# EAGLE design FlybackCape (EAGLE 7.2.0)

## Sheet 1 of 2
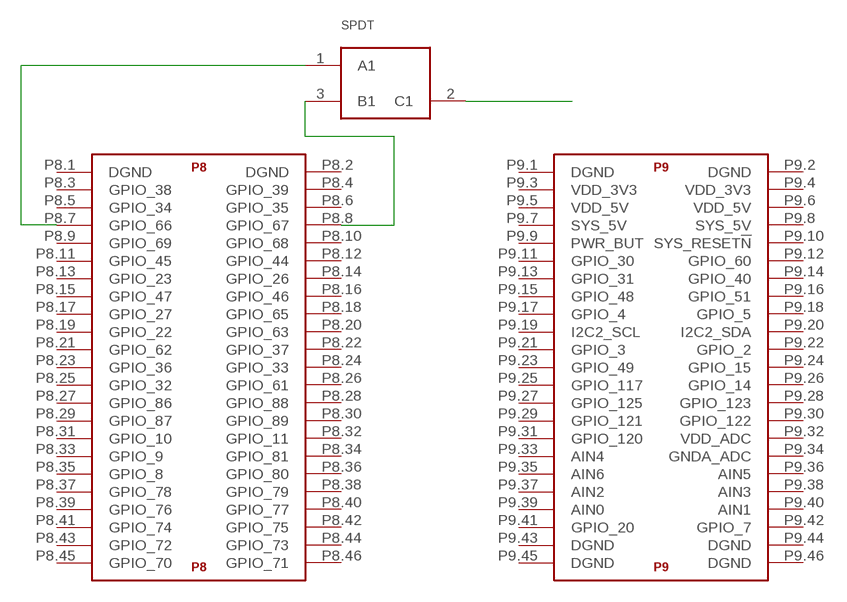
[diagram p0: schematic, sheet 1]

### Parts
SPDT  SPDT_SWITCH  [SPDT]
U$2  BEAGLE_BONE_BLACK_CAPE  [BEAGLE_BONE_BLACK_CAPE]

### Nets
EN: SPDT.2(C1) ; also sheet 2
N$10: SPDT.1(A1) U$2.P8.7(P8:GPIO_66)
N$12: SPDT.3(B1) U$2.P8.8(P8:GPIO_67)
Unconnected: U$2.P8.1(P8:DGND) U$2.P8.2(P8:DGND) U$2.P8.3(P8:GPIO_38) U$2.P8.4(P8:GPIO_39) U$2.P8.5(P8:GPIO_34) U$2.P8.6(P8:GPIO_35) U$2.P8.9(P8:GPIO_69) U$2.P8.10(P8:GPIO_68) U$2.P8.11(P8:GPIO_45) U$2.P8.12(P8:GPIO_44) U$2.P8.13(P8:GPIO_23) U$2.P8.14(P8:GPIO_26) U$2.P8.15(P8:GPIO_47) U$2.P8.16(P8:GPIO_46) U$2.P8.17(P8:GPIO_27) U$2.P8.18(P8:GPIO_65) U$2.P8.19(P8:GPIO_22) U$2.P8.20(P8:GPIO_63) U$2.P8.21(P8:GPIO_62) U$2.P8.22(P8:GPIO_37) U$2.P8.23(P8:GPIO_36) U$2.P8.24(P8:GPIO_33) U$2.P8.25(P8:GPIO_32) U$2.P8.26(P8:GPIO_61) U$2.P8.27(P8:GPIO_86) U$2.P8.28(P8:GPIO_88) U$2.P8.29(P8:GPIO_87) U$2.P8.30(P8:GPIO_89) U$2.P8.31(P8:GPIO_10) U$2.P8.32(P8:GPIO_11) U$2.P8.33(P8:GPIO_9) U$2.P8.34(P8:GPIO_81) U$2.P8.35(P8:GPIO_8) U$2.P8.36(P8:GPIO_80) U$2.P8.37(P8:GPIO_78) U$2.P8.38(P8:GPIO_79) U$2.P8.39(P8:GPIO_76) U$2.P8.40(P8:GPIO_77) U$2.P8.41(P8:GPIO_74) U$2.P8.42(P8:GPIO_75) U$2.P8.43(P8:GPIO_72) U$2.P8.44(P8:GPIO_73) U$2.P8.45(P8:GPIO_70) U$2.P8.46(P8:GPIO_71) U$2.P9.1(P9:DGND) U$2.P9.2(P9:DGND) U$2.P9.3(P9:VDD_3V3) U$2.P9.4(P9:VDD_3V3) U$2.P9.5(P9:VDD_5V) U$2.P9.6(P9:VDD_5V) U$2.P9.7(P9:SYS_5V) U$2.P9.8(P9:SYS_5V) U$2.P9.9(P9:PWR_BUT) U$2.P9.10(P9:SYS_RESET!N) U$2.P9.11(P9:GPIO_30) U$2.P9.12(P9:GPIO_60) U$2.P9.13(P9:GPIO_31) U$2.P9.14(P9:GPIO_40) U$2.P9.15(P9:GPIO_48) U$2.P9.16(P9:GPIO_51) U$2.P9.17(P9:GPIO_4) U$2.P9.18(P9:GPIO_5) U$2.P9.19(P9:I2C2_SCL) U$2.P9.20(P9:I2C2_SDA) U$2.P9.21(P9:GPIO_3) U$2.P9.22(P9:GPIO_2) U$2.P9.23(P9:GPIO_49) U$2.P9.24(P9:GPIO_15) U$2.P9.25(P9:GPIO_117) U$2.P9.26(P9:GPIO_14) U$2.P9.27(P9:GPIO_125) U$2.P9.28(P9:GPIO_123) U$2.P9.29(P9:GPIO_121) U$2.P9.30(P9:GPIO_122) U$2.P9.31(P9:GPIO_120) U$2.P9.32(P9:VDD_ADC) U$2.P9.33(P9:AIN4) U$2.P9.34(P9:GNDA_ADC) U$2.P9.35(P9:AIN6) U$2.P9.36(P9:AIN5) U$2.P9.37(P9:AIN2) U$2.P9.38(P9:AIN3) U$2.P9.39(P9:AIN0) U$2.P9.40(P9:AIN1) U$2.P9.41(P9:GPIO_20) U$2.P9.42(P9:GPIO_7) U$2.P9.43(P9:DGND) U$2.P9.44(P9:DGND) U$2.P9.45(P9:DGND) U$2.P9.46(P9:DGND)

## Sheet 2 of 2
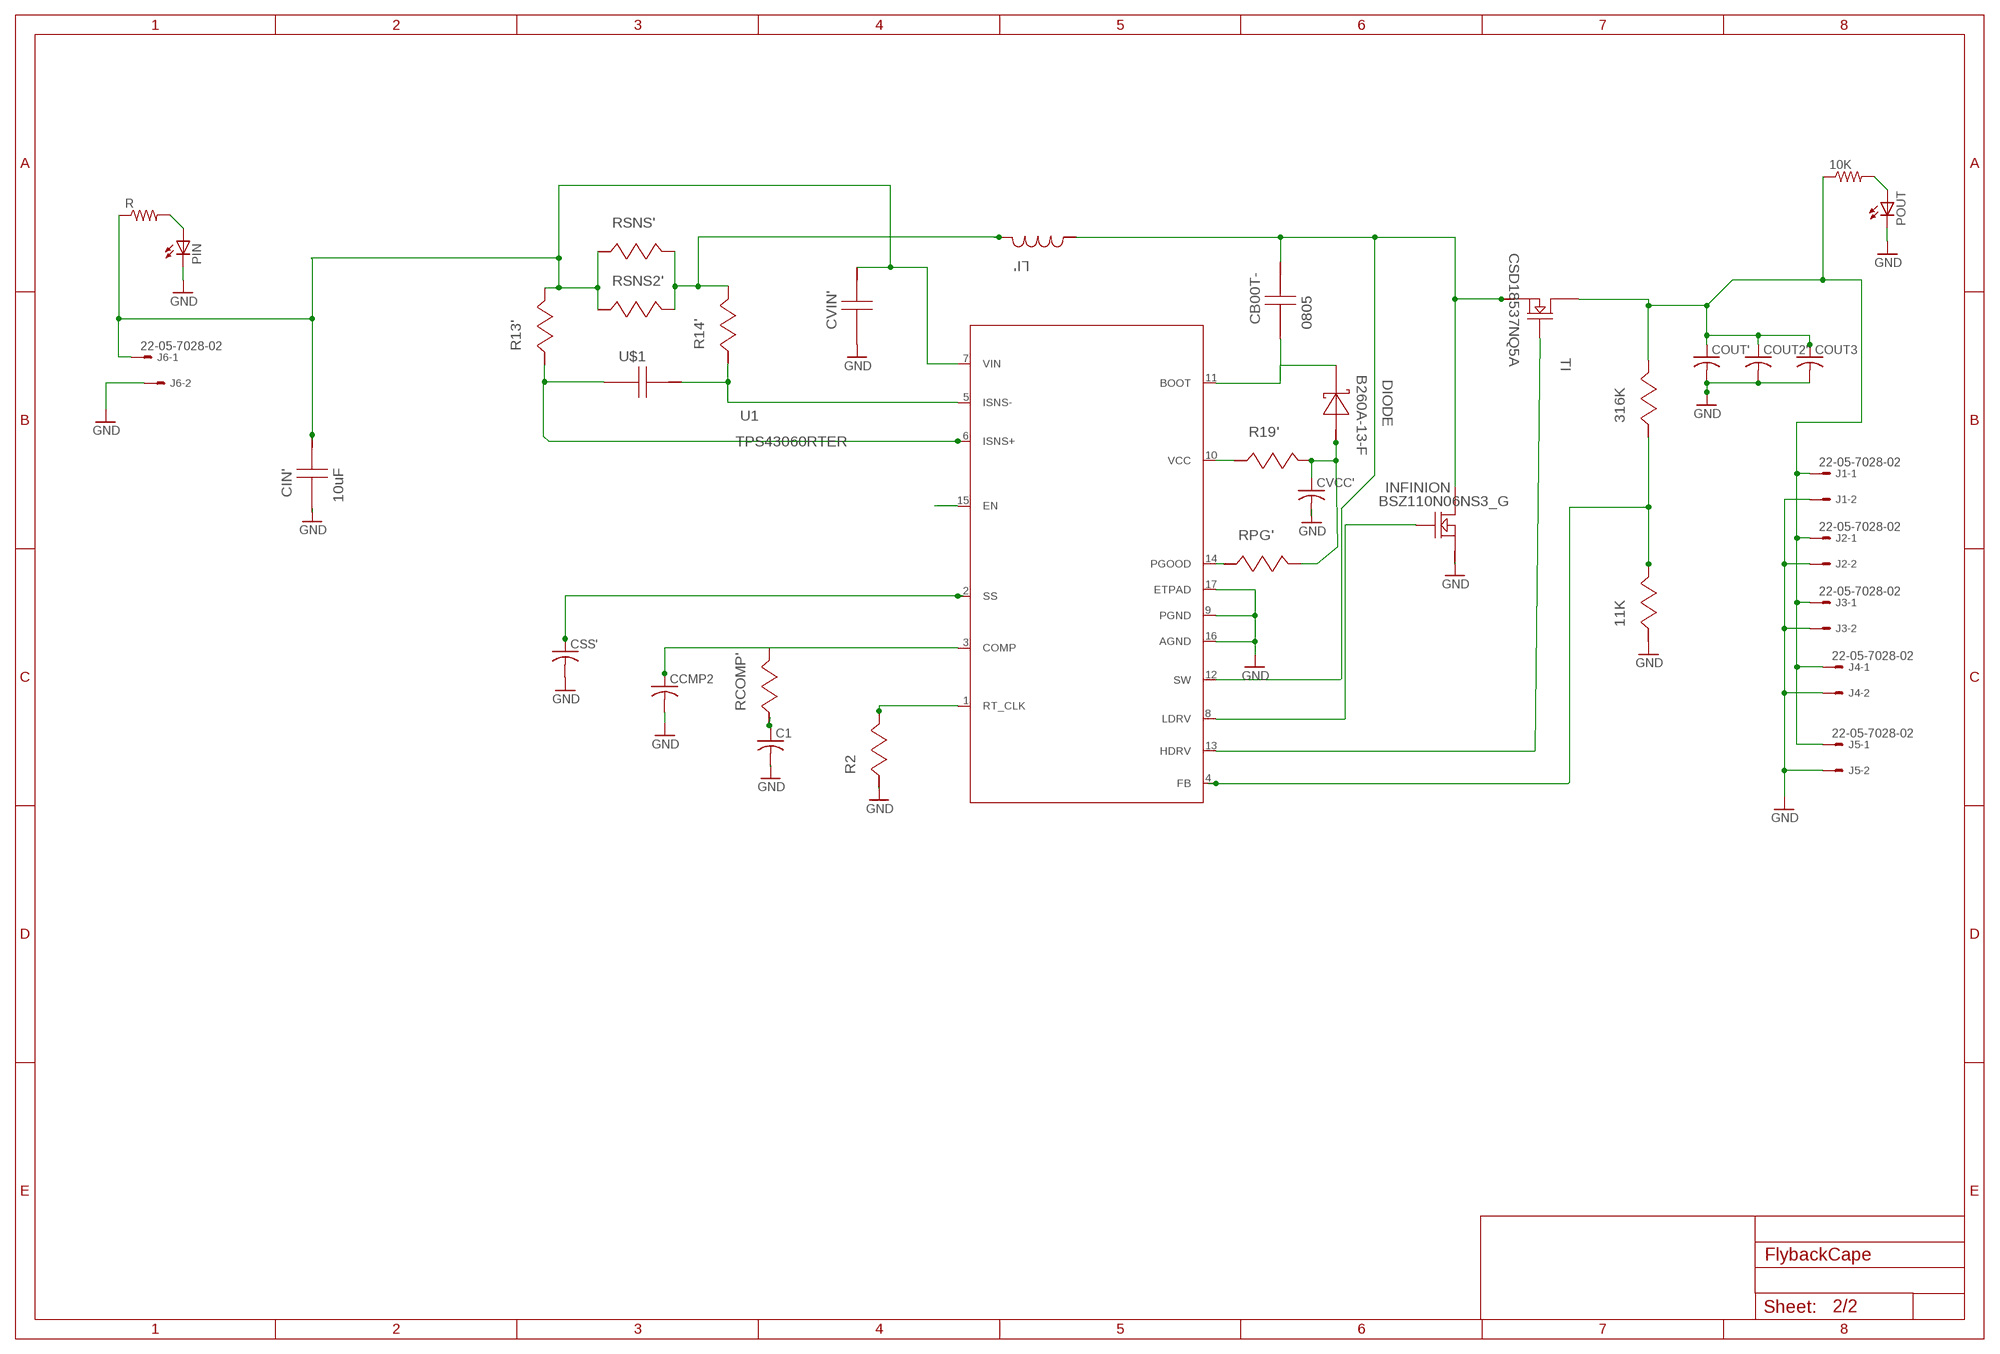
[diagram p1: schematic, sheet 2]

### Parts
10K  R-US_R1206  [R1206]
11K  CRCW0402110KFKED  [0402]
316K  CRCW0402110KFKED  [0402]
C1  C-USC0805  [C0805]
CB00T-  0805  08053C104KAT2A  [0805]
CCMP2  C-USC0402  [C0402]
CIN'  10uF  C3225X7S2A475M  [1210]
COUT2'  C-USC1812  [C1812]
COUT3  C-USC1812  [C1812]
COUT'  C-USC1812  [C1812]
CSS'  C-USC0603K  [C0603K]
CVCC'  C-USC0805  [C0805]
CVIN'  08053C104KAT2A  [0805]
DIODE  B260A-13-F  [SMA]
INFINION  BSZ110N06NS3_G  [PG-TSDSON-8]
J1  22-05-7028-02  [7395-02]
J2  22-05-7028-02  [7395-02]
J3  22-05-7028-02  [7395-02]
J4  22-05-7028-02  [7395-02]
J5  22-05-7028-02  [7395-02]
J6  22-05-7028-02  [7395-02]
LI'  MSS1210-153MEB  [MSS1210]
PIN  LEDCHIPLED_1206  [CHIPLED_1206]
POUT  LEDCHIPLED_1206  [CHIPLED_1206]
R  R-US_R1206  [R1206]
R2  CRCW04023K32FKED  [0402]
R13'  CRCW04022R00FKED  [0402]
R14'  CRCW04022R00FKED  [0402]
R19'  CRCW04022R00FKED  [0402]
RCOMP'  CRCW04023K32FKED  [0402]
RPG'  CRCW0402100KFKED  [0402]
RSNS2'  PRL1632-R012-F-T1  [1206]
RSNS'  PRL1632-R012-F-T1  [1206]
TI  CSD18537NQ5A  [TRANS_NEXFET_Q5A]
U1  TPS43060RTER  [S-PVQFN-N16]
U$1  GRM188R61C106MA73D  [0603]

### Nets
CSS: CSS'.1 U1.2(SS)
EN: U1.15(EN) ; also sheet 1
GND: 11K.2 C1.2 CCMP2.2 CIN'.2 COUT2'.2 COUT3.2 COUT'.2 CSS'.2 CVCC'.2 CVIN'.2 INFINION.1(SOURCE_2) INFINION.2(SOURCE_2) INFINION.3(SOURCE_2) J1.2 J2.2 J3.2 J4.2 J5.2 J6.2 PIN.C POUT.C R2.2 U1.9(PGND) U1.16(AGND) U1.17(ETPAD)
LNEG: CB00T-.1 INFINION.5(DRAIN_2) INFINION.6(DRAIN_2) INFINION.7(DRAIN_2) INFINION.8(DRAIN_2) INFINION.9(DRAIN_2) LI'.2 TI.1(SOURCE_2) TI.2(SOURCE_2) TI.3(SOURCE_2) U1.12(SW)
LPOS: LI'.1 R14'.1 RSNS2'.1 RSNS'.1
N$1: INFINION.4(GATE) U1.8(LDRV)
N$3: CB00T-.2 DIODE.1(K) U1.11(BOOT)
N$4: CVCC'.1 DIODE.2(A) R19'.1 RPG'.1
N$5: R19'.2 U1.10(VCC)
N$6: RPG'.2 U1.14(PGOOD)
N$7: 10K.2 POUT.A
N$8: PIN.A R.2
N$9: 11K.1 316K.2 U1.4(FB)
N$11: C1.1 RCOMP'.2
N$13: R14'.2 U1.5(ISNS-) U$1.1
N$14: R13'.2 U1.6(ISNS+) U$1.2
N$15: R2.1 U1.1(RT_CLK)
N$16: CCMP2.1 RCOMP'.1 U1.3(COMP)
TI: TI.4(GATE) U1.13(HDRV)
VIN: CIN'.1 CVIN'.1 J6.1 R13'.1 R.1 RSNS2'.2 RSNS'.2 U1.7(VIN)
VOUT: 10K.1 316K.1 COUT2'.1 COUT3.1 COUT'.1 J1.1 J2.1 J3.1 J4.1 J5.1 TI.5(DRAIN_2) TI.6(DRAIN_2) TI.7(DRAIN_2) TI.8(DRAIN_2) TI.9(DRAIN_2)

## Library data of the parts
10K R = rcl:R-US_: RESISTOR, American symbol
11K 316K = flybackWebBench:CRCW0402110KFKED; MANUFACTURER_NAME: Vishay-Dale; MANUFACTURER_PART_NUMBER: CRCW0402110KFKED; POWER: 0.063; RESISTANCE: 110000.0; TOLERANCE: 1.0; VENDOR: Vishay-Dale
C1 CCMP2 COUT2' COUT3 COUT' CSS' CVCC' = rcl:C-US: CAPACITOR, American symbol
CB00T- CVIN' = flybackWebBench:08053C104KAT2A; CAP: 1.0E-7; ESR: 0.28; IRMS: 0.0; MANUFACTURER_NAME: AVX; MANUFACTURER_PART_NUMBER: 08053C104KAT2A; VDC: 25.0; VENDOR: AVX
CIN' = flybackWebBench:C3225X7S2A475M; CAP: 4.7E-6; DATASHEETURL: http://www.tdk.co.jp/tefe02/e4655%5Fc.pdf; ESR: 0.004547; IRMS: 0.0; MANUFACTURER_NAME: TDK; MANUFACTURER_PART_NUMBER: C3225X7S2A475M; VDC: 100.0; VENDOR: TDK
DIODE = flybackWebBench:B260A-13-F; DATASHEETURL: http://www.diodes.com/datasheets/ds13004.pdf; IO: 2.0; MANUFACTURER_NAME: Diodes Inc.; MANUFACTURER_PART_NUMBER: B260A-13-F; VENDOR: Diodes Inc.; VFATIO: 0.7; VRRM: 60.0
INFINION = flybackWebBench:BSZ110N06NS3_G; DATASHEETURL: http://www.infineon.com/dgdl/BSZ110N06NS3%5FRev2.4.pdf?folderId%3Ddb3a30431ddc9372011ebafa04517f8b%26fileId%3Ddb3a30431ddc9372011ebb15d4e8001a; IDSMAX: 20.0; MANUFACTURER_NAME: Infineon Technologies; MANUFACTURER_PART_NUMBER: BSZ110N06NS3 G; QGTYP: 25.0; QUANTITY: 1; RDSON45: 101.0; VDSMAX: 60.0; VENDOR: Infineon Technologies
J1-J6 = range_cape:22-?-02: CONNECTOR wire to board 2.54 mm (.1 inch) pitch header; OC_FARNELL: 9731601; OC_NEWARK: unknown
LI' = flybackWebBench:MSS1210-153MEB; DATASHEETURL: http://www.coilcraft.com/pdfs/mss1210.pdf; DCR: 0.019; DESCRIPTION: Unknown; IDC: 8.7; L: 1.5E-5; MANUFACTURER: CoilCraft; MANUFACTURER_NAME: Coilcraft; MANUFACTURER_PART_NUMBER: MSS1210-153MEB; PACKAGE_DESIGNATOR: MSS1210; VENDOR: Coilcraft
PIN POUT = led:LED: LED OSRAM: - CHIPLED LG R971, LG N971, LY N971, LG Q971, LY Q971, LO R971, LY R971 LH N974, LH R974 LS Q976, LO Q976, LY Q976 LO Q996 - Hyper CHIPLED LW Q18S LB Q993, LB Q99A, LB R99A - SideLED LS A670, LO A670, LY A670, LG A670, LP A670 LB A673, LV A673, LT A673, LW A673 LH A674 LY A675 LS A676, LA A676, LO A676, LY A676, LW A676 LS A679, LY A679, LG A679 - Hyper Micro SIDELED® LS Y876, LA Y876, LO Y876, LY Y876 LT Y87S - SmartLED LW L88C, LW L88S LB L89C, LB L89S, LG L890 LS L89K, LO L89K, LY L89K LS L896, LA L896, LO L896, LY L896 - TOPLED LS T670, LO T670, LY T670, LG T670, LP T670 LSG T670, LSP T670, LSY T670, LOP T670, LYG T670 LG T671, LOG T671, LSG T671 LB T673, LV T673, LT T673, LW T673 LH T674 LS T676, LA T676, LO T676, LY T676, LB T676, LH T676, LSB T676, LW T676 LB T67C, LV T67C, LT T67C, LS T67K, LO T67K, LY T67K, LW E67C LS E67B, LA E67B, LO E67B, LY E67B, LB E67C, LV E67C, LT E67C LW T67C LS T679, LY T679, LG T679 LS T770, LO T770, LY T770, LG T770, LP T770 LB T773, LV T773, LT T773, LW T773 LH T774 LS E675, LA E675, LY E675, LS T675 LS T776, LA T776, LO T776, LY T776, LB T776 LHGB T686 LT T68C, LB T68C - Hyper Mini TOPLED® LB M676 - Mini TOPLED Santana® LG M470 LS M47K, LO M47K, LY M47K Source: http://www.osram.convergy.de LUXEON: - LUMILED® LXK2-PW12-R00, LXK2-PW12-S00, LXK2-PW14-U00, LXK2-PW14-V00 LXK2-PM12-R00, LXK2-PM12-S00, LXK2-PM14-U00 LXK2-PE12-Q00, LXK2-PE12-R00, LXK2-PE12-S00, LXK2-PE14-T00, LXK2-PE14-U00 LXK2-PB12-K00, LXK2-PB12-L00, LXK2-PB12-M00, LXK2-PB14-N00, LXK2-PB14-P00, LXK2-PB14-Q00 LXK2-PR12-L00, LXK2-PR12-M00, LXK2-PR14-Q00, LXK2-PR14-R00 LXK2-PD12-Q00, LXK2-PD12-R00, LXK2-PD12-S00 LXK2-PH12-R00, LXK2-PH12-S00 LXK2-PL12-P00, LXK2-PL12-Q00, LXK2-PL12-R00 Source: www.luxeon.com KINGBRIGHT: KA-3528ASYC Source: www.kingbright.com
R2 RCOMP' = flybackWebBench:CRCW04023K32FKED; MANUFACTURER_NAME: Vishay-Dale; MANUFACTURER_PART_NUMBER: CRCW04023K32FKED; POWER: 0.063; RESISTANCE: 3320.0; TOLERANCE: 1.0; VENDOR: Vishay-Dale
R13' R14' R19' = flybackWebBench:CRCW04022R00FKED; MANUFACTURER_NAME: Vishay-Dale; MANUFACTURER_PART_NUMBER: CRCW04022R00FKED; POWER: 0.063; RESISTANCE: 2.0; TOLERANCE: 1.0; VENDOR: Vishay-Dale
RPG' = flybackWebBench:CRCW0402100KFKED; MANUFACTURER_NAME: Vishay-Dale; MANUFACTURER_PART_NUMBER: CRCW0402100KFKED; POWER: 0.063; RESISTANCE: 100000.0; TOLERANCE: 1.0; VENDOR: Vishay-Dale
RSNS2' RSNS' = flybackWebBench:PRL1632-R012-F-T1; MANUFACTURER_NAME: Susumu Co Ltd; MANUFACTURER_PART_NUMBER: PRL1632-R012-F-T1; POWER: 1.0; RESISTANCE: 0.012; TOLERANCE: 1.0; VENDOR: Susumu Co Ltd
SPDT = range_cape:SPDT_SWITCH
TI = flybackWebBench:CSD18537NQ5A; DATASHEETURL: http://www.ti.com/lit/ds/symlink/csd18537nq5a.pdf; IDSMAX: 50.0; MANUFACTURER_NAME: Texas Instruments; MANUFACTURER_PART_NUMBER: CSD18537NQ5A; QGTYP: 14.0; QUANTITY: 1; RDSON45: 0.014559999999999998; VDSMAX: 60.0; VENDOR: Texas Instruments
U1 = flybackWebBench:TPS43060RTER; DATASHEETURL: http://www.ti.com/product/tps43060; FREQUENCY: 1000000.0; IMAX: 15.0; MANUFACTURER_NAME: Texas Instruments; MANUFACTURER_PART_NUMBER: TPS43060RTER; MKTG_PACKAGE: TPS43060; NSID: TPS43060RTER; PACKAGE: TPS43060; VENDOR: Texas Instruments
U$1 = flybackWebBench:GRM188R61C106MA73D; CAP: 1.0E-5; ESR: 0; IRMS: 0; MANUFACTURER_NAME: MuRata; MANUFACTURER_PART_NUMBER: GRM188R61C106MA73D; VDC: 16; VENDOR: Murata
U$2 = range_cape:BEAGLE_BONE_BLACK_CAPE

## Board
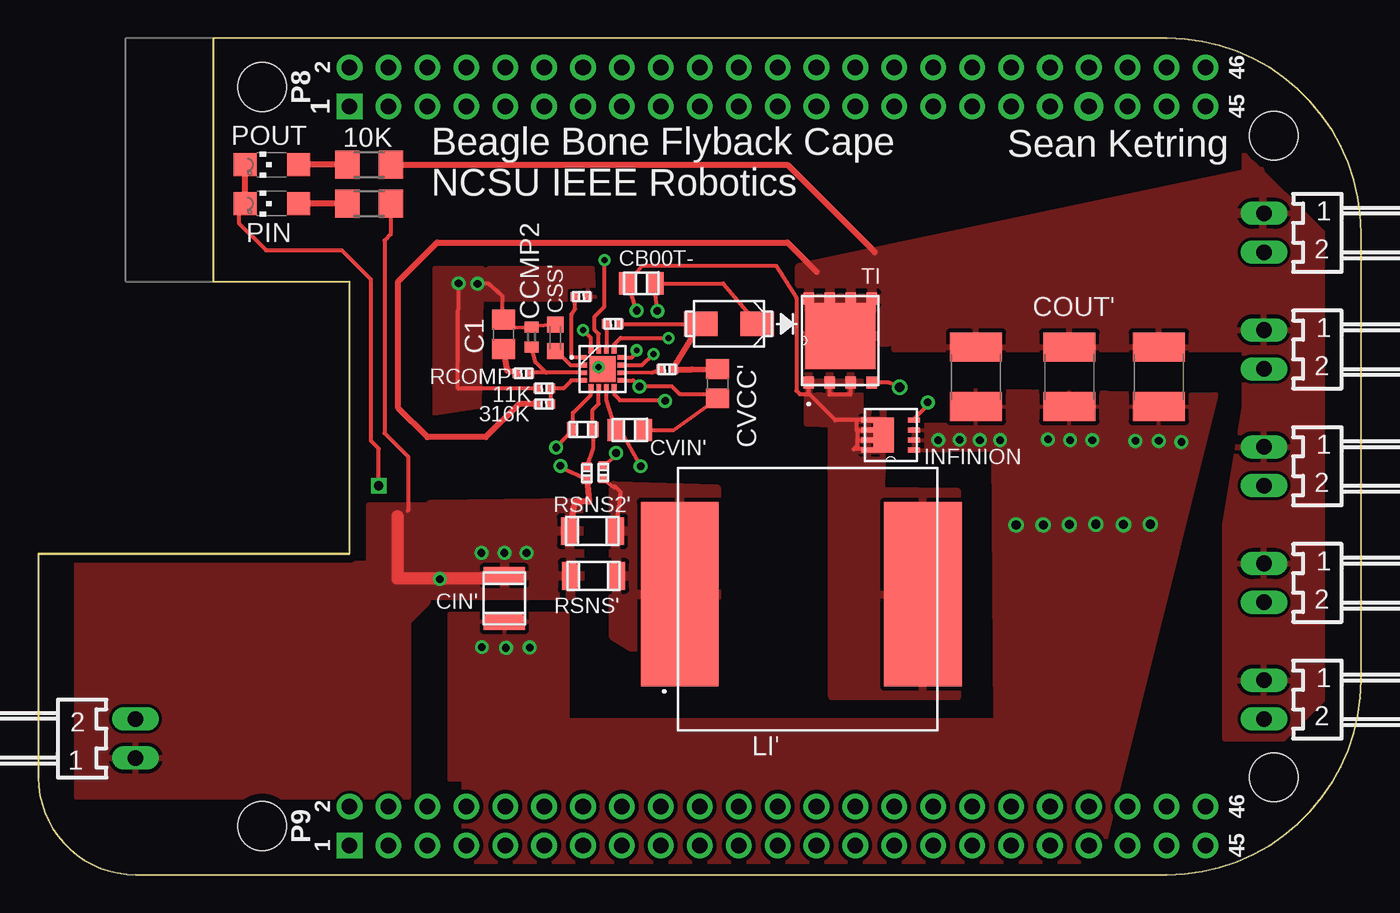
[diagram p2: board, top side]
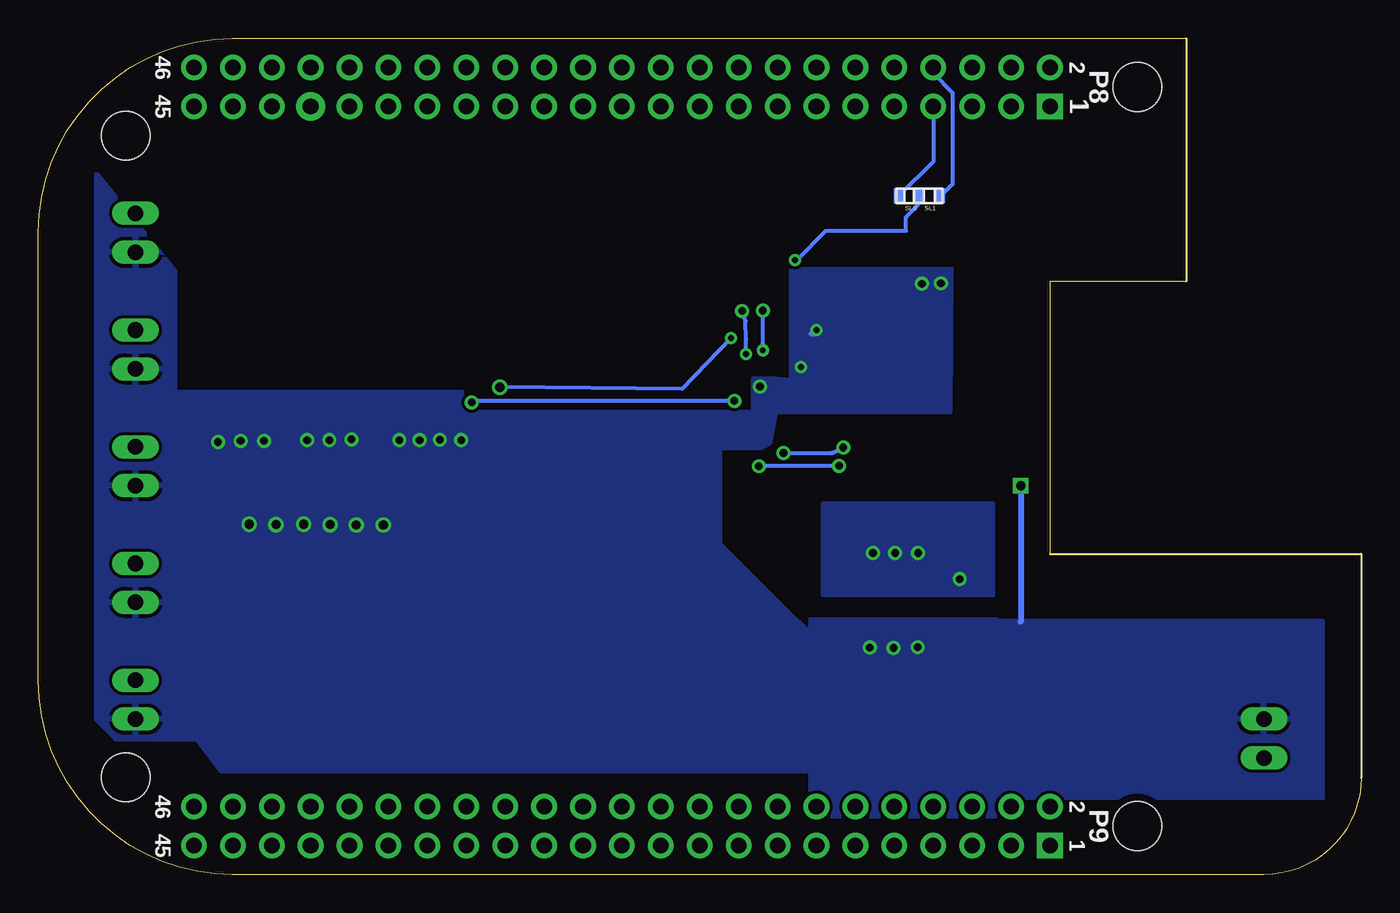
[diagram p3: board, bottom side, seen from below]

Size 86.36 x 54.61 mm. Coordinates in mm from the lower left corner, seen from the top.
Outline: 6.35,0 73.66,0 arc90 86.36,12.7 86.36,41.91 arc90 73.66,54.61 11.43,54.61 11.43,38.73 20.32,38.73 20.32,20.95 0,20.95 0,6.35 arc90 6.35,0
Copper layers (1*16): Top 0.035mm / dielectric 1.5mm / Bottom 0.035mm
Design rules "default *": minimum track width 10mil, minimum drill 15mil, track to track 8mil, track to pad 8mil, pad to pad 8mil, via to via 8mil, smd to smd 8mil, copper to edge 20mil, drill to drill 8mil, minimum pad ring 10mil, minimum via ring 8mil, stop-mask expansion 4mil, vias tented up to drill 0mil, thermal gap 10mil

### Footprints (pad centres in the part's own frame; a part is rotated, then mirrored left to right if it is on the bottom)
R1206 = smd 1.6 x 1.803: 1 -1.422,0; 2 1.422,0
0402 = smd 0.559 x 0.61: 1 -0.419,0; 2 0.419,0
C0805 = smd 1.3 x 1.5: 1 -0.95,0; 2 0.95,0
0805 = smd 1.118 x 1.448: 1 -0.902,0; 2 0.902,0
C0402 = smd 0.7 x 0.9: 1 -0.65,0; 2 0.65,0
1210 = smd 1.118 x 2.692: 1 -1.499,0; 2 1.499,0
C1812 = smd 1.9 x 3.4: 1 -1.95,0; 2 1.95,0
C0603K = smd 1.05 x 1.08: 1 -0.875,0; 2 0.875,0
SMA = smd 2.184 x 1.626: 1 -1.854,0; 2 1.854,0
PG-TSDSON-8 = smd 0.787 x 0.33: 1 -1.511,0.975; 2 -1.511,0.325; 3 -1.511,-0.325; 4 -1.511,-0.975; 5 1.511,-0.975; 6 1.511,-0.325; 7 1.511,0.325; 8 1.511,0.975 | smd 1.321 x 2.286: 9 0.457,0
7395-02 = drill 1.016 long: 1 1.27,0; 2 -1.27,0
MSS1210 = smd 5.08 x 12.065: 1 0.318,8.89; 2 16.192,8.89
CHIPLED_1206 = smd 1.5 x 1.5: A 0,-1.75; C 0,1.75
1206 = smd 1.118 x 1.803: 1 -1.499,0; 2 1.499,0
SPDT = smd 0.66 x 0.965: 1 -0.699,0; 2 0.572,0; 3 1.968,0
TRANS_NEXFET_Q5A = smd 0.787 x 0.711: 1 -2.752,2.055; 2 -2.752,0.685; 3 -2.752,-0.685; 4 -2.752,-2.055; 5 2.752,-2.055; 6 2.752,-0.685; 7 2.752,0.685; 8 2.752,2.055 | smd 4.293 x 4.572: 9 0.3,0
S-PVQFN-N16 = smd 0.508 x 0.305: 1 -1.25,0.75; 2 -1.25,0.25; 3 -1.25,-0.25; 4 -1.25,-0.75; 9 1.25,-0.75; 10 1.25,-0.25; 11 1.25,0.25; 12 1.25,0.75 | smd 0.305 x 0.508: 5 -0.75,-1.25; 6 -0.25,-1.25; 7 0.25,-1.25; 8 0.75,-1.25; 13 0.75,1.25; 14 0.25,1.25; 15 -0.25,1.25; 16 -0.75,1.25 | smd 1.702 x 1.702: 17 0,0
0603 = smd 0.66 x 0.965: 1 -0.699,0; 2 0.699,0
BEAGLE_BONE_BLACK_CAPE = drill 1.016 pad 1.676 square: P8.1 20.32,50.165; P9.1 20.32,1.905 | drill 1.016 pad 1.676: P8.2 20.32,52.705; P8.3 22.86,50.165; P8.4 22.86,52.705; P8.5 25.4,50.165; P8.6 25.4,52.705; P8.7 27.94,50.165; P8.8 27.94,52.705; P8.9 30.48,50.165; P8.10 30.48,52.705; P8.11 33.02,50.165; P8.12 33.02,52.705; P8.13 35.56,50.165; P8.14 35.56,52.705; P8.15 38.1,50.165; P8.16 38.1,52.705; P8.17 40.64,50.165; P8.18 40.64,52.705; P8.19 43.18,50.165; P8.20 43.18,52.705; P8.21 45.72,50.165; P8.22 45.72,52.705; P8.23 48.26,50.165; P8.24 48.26,52.705; P8.25 50.8,50.165; P8.26 50.8,52.705; P8.27 53.34,50.165; P8.28 53.34,52.705; P8.29 55.88,50.165; P8.30 55.88,52.705; P8.31 58.42,50.165; P8.32 58.42,52.705; P8.33 60.96,50.165; P8.34 60.96,52.705; P8.35 63.5,50.165; P8.36 63.5,52.705; P8.37 66.04,50.165; P8.38 66.04,52.705; P8.40 68.58,52.705; P8.41 71.12,50.165; P8.42 71.12,52.705; P8.43 73.66,50.165; P8.44 73.66,52.705; P8.45 76.2,50.165; P8.46 76.2,52.705; P9.2 20.32,4.445; P9.3 22.86,1.905; P9.4 22.86,4.445; P9.5 25.4,1.905; P9.6 25.4,4.445; P9.7 27.94,1.905; P9.8 27.94,4.445; P9.9 30.48,1.905; P9.10 30.48,4.445; P9.11 33.02,1.905; P9.12 33.02,4.445; P9.13 35.56,1.905; P9.14 35.56,4.445; P9.15 38.1,1.905; P9.16 38.1,4.445; P9.17 40.64,1.905; P9.18 40.64,4.445; P9.19 43.18,1.905; P9.20 43.18,4.445; P9.21 45.72,1.905; P9.22 45.72,4.445; P9.23 48.26,1.905; P9.24 48.26,4.445; P9.25 50.8,1.905; P9.26 50.8,4.445; P9.27 53.34,1.905; P9.28 53.34,4.445; P9.29 55.88,1.905; P9.30 55.88,4.445; P9.31 58.42,1.905; P9.32 58.42,4.445; P9.33 60.96,1.905; P9.34 60.96,4.445; P9.35 63.5,1.905; P9.36 63.5,4.445; P9.37 66.04,1.905; P9.38 66.04,4.445; P9.39 68.58,1.905; P9.40 68.58,4.445; P9.41 71.12,1.905; P9.42 71.12,4.445; P9.43 73.66,1.905; P9.44 73.66,4.445; P9.45 76.2,1.905; P9.46 76.2,4.445 | drill 1.016 pad 1.88: P8.39 68.58,50.165 | hole 3.175: 14.605,3.175; 80.645,6.35; 80.645,48.26; 14.605,51.435

### Placement (x,y rotation side)
10K  21.59,46.35 180 top
11K  33.02,31.75 180 top
316K  33.02,30.73 0 top
C1  30.38,35.28 90 top
CB00T-  39.37,38.61 0 top
CCMP2  32.21,35.1 90 top
CIN'  30.43,18.03 270 top
COUT2'  73.15,32.51 270 top
COUT3  67.31,32.51 270 top
COUT'  61.21,32.51 270 top
CSS'  33.76,35.05 90 top
CVCC'  44.35,32.05 270 top
CVIN'  38.61,29.03 0 top
DIODE  45.09,35.97 180 top
INFINION  55.65,28.7 180 top
J1  80.01,41.91 90 top
J2  80.01,34.29 90 top
J3  80.01,26.67 90 top
J4  80.01,19.05 90 top
J5  80.01,11.43 90 top
J6  6.35,8.89 270 top
LI'  41.55,9.42 0 top
PIN  15.24,43.81 90 top
POUT  15.24,46.35 90 top
R  21.59,43.81 180 top
R2  35.46,37.74 0 top
R13'  35.81,26.21 90 top
R14'  36.88,26.26 90 top
R19'  41.05,32.99 180 top
RCOMP'  31.67,32.74 180 top
RPG'  37.52,35.97 180 top
RSNS2'  36.17,22.43 180 top
RSNS'  36.25,19.51 180 top
SPDT  29.46,44.32 0 bottom
TI  52.35,34.87 90 top
U1  36.83,33.02 0 top
U$1  35.53,29.06 0 top
U$2  0,0 0 top

### Tracks (layer width: path | path; a pad name or v marks a point on that pad's centre or on a via)
CSS
  Top 0.254: CSS'.1 33.95,34.08 34.75,33.27 U1.2
EN  (via drill 0.38)
  Top 0.254: U1.15 36.58,35.3 36.32,35.56 36.32,36.45 36.96,37.08 v36.96,40.13
  Bottom 0.254: v36.96,40.13 36.83,40.13 34.92,42.04 29.72,42.04 29.72,42.93 28.96,43.69 28.96,44.26 SPDT.2
GND  (via drill 0.38, 0.5, 0.6)
  Top 0.254: 27.38,31.75 v27.43,38.61 | 11K.2 27.38,31.75 | 27.38,31.75 27.43,31.73 | CVIN'.2 41.46,29.03 CVCC'.2 43.8,31.39 41.86,31.39 41.35,31.9 39.29,31.9 39.24,31.85 | v28.68,38.58 29.39,38.58 30.3,37.77 30.3,36.36 C1.2 30.93,35.73 CCMP2.2 32.28,35.85 CSS'.2 | 39.22,31.83 39.24,31.85 | 39.24,31.85 v39.24,31.88 38.85,32.27 U1.9 | v22.23,25.4 22.23,27.81 21.72,28.32 21.72,38.86 19.81,40.77 14.86,40.77 13.08,42.55 13.08,43.41 PIN.C | U1.17 36.7,33.15 v36.58,33.15 | U1.16 36.07,34.28 36.07,35.05 v35.56,35.56
  Top 0.406: PIN.C POUT.C
  Bottom 0.254: v35.56,35.56 35.94,35.31 35.69,35.31
  Bottom 0.406: v22.23,25.4 22.23,16.51
  other vias: 58.75,28.37 60.15,28.4 61.47,28.37 62.79,28.37 65.91,28.42 67.36,28.37 68.81,28.37 71.63,28.32 73.15,28.32 74.63,28.24 28.96,14.86 30.53,14.81 32.08,14.83 63.83,22.83 65.61,22.83 67.31,22.86 69.04,22.89 70.84,22.86 72.59,22.89
  pour Bottom: 38.28,32.41 37.21,32.33 37.21,39.57 26.75,39.6 26.82,30.18 39.7,30.18 39.7,32.44 38.28,32.44
  pour Top (isolate 0.254): 56.9,28.68 56.92,27.69 62.33,27.76 62.46,10.08 34.57,10.08 34.57,17.02 26.82,17.02 26.82,6.22 27.74,6.22 27.74,0.84 69.32,0.84 76.94,31.34 76.58,31.34 76.58,31.32 59.82,31.65 59.82,29.41 59,29.36 56.87,29.36
  pour Bottom: 39.17,27.84 56.87,27.84 56.87,26.67 77.14,26.67 77.14,31.55 58.7,31.55 58.7,30.25 38.2,30.25 38.61,28.14
  pour Top: 29.13,37.54 34.49,37.52 34.47,38.38 35.51,38.38 35.51,38.35 35.64,38.35 35.64,37.69 36.35,37.69 36.22,39.6 29.36,39.6 29.36,39.52 28.55,39.6
  pour Top: 28.8,30.53 25.86,30.07 25.88,39.62 28.96,39.65
  pour Bottom: 23.72,16.66 35.99,16.66 35.99,3.81 23.77,3.81 23.77,8.36 23.72,8.36
  pour Bottom: 36.63,16.46 53.14,16.46 61.19,24.51 82.07,30.89 82.27,30.68 82.4,17.22 74.47,6.76 36.22,6.76 35.05,7.92 35.05,14.88
  pour Bottom: 24.13,5.08 2.54,5.08 2.54,16.51 24.13,16.51
  pour Bottom: 60.96,22.86 60.96,26.67 77.47,26.67 77.47,39.37 82.55,45.72 82.55,10.16 81.28,8.89 74.93,8.89 73.66,7.62 73.66,10.16
  pour Bottom: 41.91,27.94 41.91,21.59 36.83,16.51 54.61,16.51 63.5,25.4 63.5,27.94
LNEG  (via drill 0.38, 0.5)
  Top 0.254: v39.06,36.83 38.67,38.1 CB00T-.1 39.38,39.75 48.18,39.75 49.48,37.67 49.48,31.6 49.71,31.37 50.34,31.37 | U1.12 38.77,33.77 v39.06,34.24 | 50.34,31.37 52.03,29.68 53.35,29.68 53.37,29.69 | 50.34,31.37 50.29,31.42 TI.1 | TI.3 53.01,32.1 53.01,31.34 51.64,31.34 51.66,31.37 TI.2 | INFINION.5 54.12,29.69 53.37,29.69 | 53.37,29.69 53.42,29.64 53.42,29.03 INFINION.6 54.12,29.01 53.42,29.01 53.47,28.96 53.47,28.4 53.49,28.38 | 53.49,28.38 INFINION.7 54.87,28.38 INFINION.9 | INFINION.8 54.08,27.79 53.24,27.79 53.49,28.04 53.49,28.38
  Bottom 0.254: v39.06,34.24 v39.06,36.83
  pour Top: 50.24,29.49 50.24,32.77 53.59,32.61 53.59,30.1 55.09,30.23 55.02,25.1 59.97,25.02 59.97,11.63 51.82,11.63 51.82,29.44
LPOS
  Top 0.254: R14'.1 37.55,25.32 37.67,25.32 38,24.99 RSNS2'.1
  pour Top: 37.67,25.37 44.27,25.2 44.27,11.46 37.54,15.6 37.57,25.4
N$1  (via drill 0.5, 0.5 pad 0.25)
  Top 0.254: U1.8 37.59,31.77 37.59,31.37 37.97,30.99 40.87,30.99 v40.92,30.94 40.92,30.96 | v58.06,30.84 58.12,30.79 58.04,30.63 57.16,29.76 INFINION.4
  Bottom 0.254: v40.92,30.94 57.73,30.94 v58.06,30.84
N$3  (via drill 0.38, 0.5)
  Top 0.254: U1.11 39.4,33.27 v40.16,33.98 | v40.41,36.8 40.27,38.12 CB00T-.2 44.7,38.61 DIODE.1
  Bottom 0.254: v40.16,33.98 40.16,34.95 40.18,36.17 v40.41,36.8
N$4
  Top 0.254: RPG'.1 DIODE.2
  Top 0.406: DIODE.2 41.58,33.25 R19'.1 42.65,32.99 CVCC'.1
N$5
  Top 0.254: R19'.2 40.06,32.77 U1.10
N$6
  Top 0.254: RPG'.2 37.08,35.87 U1.14
N$7
  Top 0.406: 10K.2 POUT.A
N$8
  Top 0.406: R.2 PIN.A
N$9
  Top 0.254: 316K.2 11K.1 34.29,31.75 34.81,32.27 U1.4
N$10
  Bottom 0.254: U$2.P8.7 27.94,46.55 SPDT.1
N$11
  Top 0.406: RCOMP'.2 30.63,32.89 C1.1
N$12
  Bottom 0.254: U$2.P8.8 27.94,52.32 26.67,51.05 26.67,45.09 27.43,44.32 SPDT.3
N$13  (via drill 0.5)
  Top 0.254: R14'.2 37.52,27.22 v37.72,27.53 | v33.81,27.89 34.51,28.63 U$1.1 34.9,29.11 34.9,30.15 36.08,31.33 U1.5
  Bottom 0.254: v37.72,27.53 34.52,27.53 v33.81,27.89
N$14
  Top 0.254: R13'.2 36.23,27.85 U$1.2 36.2,29.08 36.2,30.35 36.58,30.74 U1.6
N$15
  Top 0.254: 35,37.74 R2.1 35.05,37.73 35.05,36.96 34.8,36.58 34.8,33.91 34.94,33.77 U1.1
N$16
  Top 0.254: 35.58,32.74 U1.3 33.15,32.77 | CCMP2.1 32.46,33.46 33.15,32.77 | 33.15,32.77 32.12,32.77 RCOMP'.1
  Top 0.406: CCMP2.1 32.16,34.49
TI  (via drill 0.38, 0.6)
  Top 0.254: 37.59,34.27 U1.13 37.59,34.28 37.59,34.62 38.02,35.05 v41.15,35.03 | 54.67,32.05 54.66,32.05 54.48,32.05 TI.4 55.51,32.12 v56.24,31.83
  Bottom 0.254: v41.15,35.03 44.32,31.73 v56.24,31.83
VIN  (via drill 0.5, 0.5 pad 0.25)
  Top 0.254: 30.43,19.33 CIN'.1 | U1.7 37.08,30.99 CVIN'.1 37.97,29.03 v39.32,26.67 | R13'.1 34.21,26.5 34.09,26.63 v34.09,26.7 | R.1 23.01,41.81 22.61,41.4 22.61,28.83 24.13,27.3 24.13,23.75
  Top 0.406: R13'.1 35.97,24.36 35.13,24.36 35.13,24.33 35,24.33 RSNS2'.2
  Top 0.813: 23.44,23.38 23.44,19.33 30.43,19.33
  Bottom 0.254: v34.09,26.7 v39.32,26.67
  other vias: 28.93,21.01 30.43,21.01 31.88,21.01 26.21,19.3
  pour Top: 35.28,24.31 35.38,18.19 35.2,18.21 35.23,18.24 25.53,18.19 25.53,23.83 25.6,23.83 25.6,24.16
  pour Bottom: 24,24.23 35.15,24.23 35.15,18.26 24,18.26
  pour Top: 25.4,17.78 24.13,16.51 24.13,5.08 2.54,5.08 2.54,20.32 21.59,20.32 21.59,24.13 25.4,24.13
VOUT
  Top 0.254: 316K.1 32.51,30.73
  Top 0.406: 32.51,30.73 31.37,30.73 29.21,28.57 25.4,28.57 23.5,30.48 23.5,38.73 26.04,41.27 48.9,41.27 50.8,39.37 | 10K.1 48.9,46.35 54.61,40.64
  pour Top: 49.68,33.55 79.76,39.9 79.76,45.97 49.68,39.62
  pour Top: 78.74,46.99 78.74,30.48 77.47,22.86 77.47,8.89 81.28,8.89 83.82,11.43 83.82,41.91
  pour Top: 57.15,36.83 80.01,39.37 80.01,34.29 55.88,34.29 55.88,35.56

### Text on the board
tNames: Beagle Bone Flyback Cape | Sean Ketring | NCSU IEEE Robotics